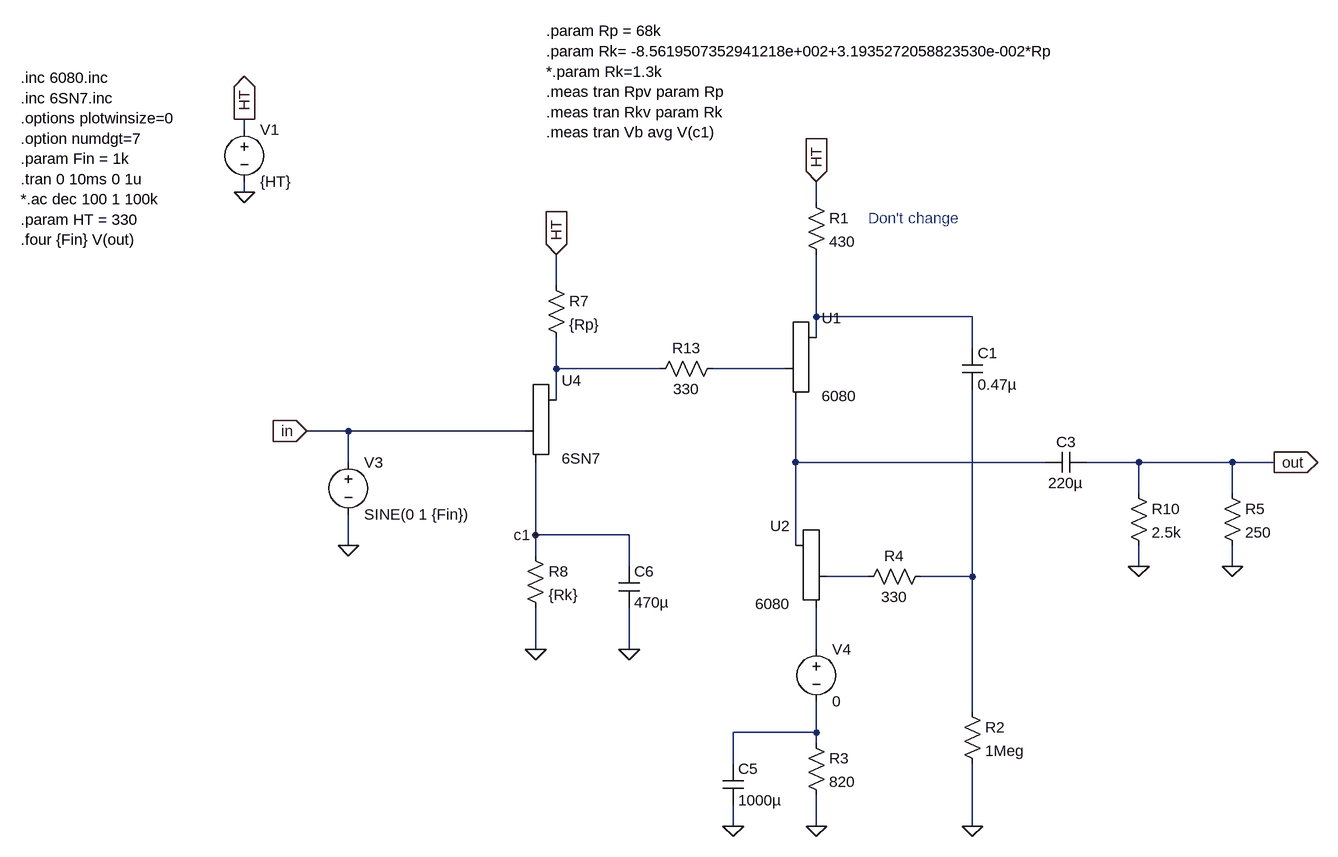
[diagram p0: schematic OTL 6SN7.asc]
OTL 6SN7.asc, the LTspice schematic file:
Version 4
SHEET 1 4876 1028
WIRE -384 -64 -384 -80
WIRE -384 32 -384 16
WIRE 496 48 496 16
WIRE 96 176 96 128
WIRE 496 224 496 128
WIRE 736 224 496 224
WIRE 496 256 496 224
WIRE 736 272 736 224
WIRE 96 304 96 256
WIRE 256 304 96 304
WIRE 448 304 336 304
WIRE 96 352 96 304
WIRE -224 400 -288 400
WIRE 48 400 -224 400
WIRE -224 448 -224 400
WIRE 464 448 464 352
WIRE 848 448 464 448
WIRE 992 448 912 448
WIRE 1136 448 992 448
WIRE 1200 448 1136 448
WIRE 992 496 992 448
WIRE 1136 496 1136 448
WIRE 64 560 64 448
WIRE 208 560 64 560
WIRE -224 576 -224 528
WIRE 464 576 464 448
WIRE 64 592 64 560
WIRE 208 608 208 560
WIRE 992 608 992 576
WIRE 1136 608 1136 576
WIRE 576 624 512 624
WIRE 736 624 736 336
WIRE 736 624 656 624
WIRE 64 736 64 672
WIRE 208 736 208 672
WIRE 496 736 496 672
WIRE 736 832 736 624
WIRE 496 864 496 816
WIRE 496 864 368 864
WIRE 496 880 496 864
WIRE 368 912 368 864
WIRE 368 1008 368 976
WIRE 496 1008 496 960
WIRE 736 1008 736 912
FLAG -384 32 0
FLAG 736 1008 0
FLAG 496 1008 0
FLAG -224 576 0
FLAG 1200 448 out
IOPIN 1200 448 Out
FLAG 1136 608 0
FLAG 368 1008 0
FLAG 496 16 HT
IOPIN 496 16 In
FLAG -384 -80 HT
IOPIN -384 -80 Out
FLAG 64 736 0
FLAG 96 128 HT
IOPIN 96 128 In
FLAG -288 400 in
IOPIN -288 400 In
FLAG 208 736 0
FLAG 992 608 0
FLAG 64 560 c1
SYMBOL Misc/triode 496 304 R0
SYMATTR InstName U1
SYMATTR Value 6080
SYMBOL voltage -384 -80 R0
SYMATTR InstName V1
SYMATTR Value {HT}
SYMBOL res 480 32 R0
SYMATTR InstName R1
SYMATTR Value 430
SYMBOL Misc/triode 464 624 M0
SYMATTR InstName U2
SYMATTR Value 6080
SYMBOL res 720 816 R0
SYMATTR InstName R2
SYMATTR Value 1Meg
SYMBOL cap 720 272 R0
SYMATTR InstName C1
SYMATTR Value 0.47µ
SYMBOL res 480 864 R0
SYMATTR InstName R3
SYMATTR Value 820
SYMBOL voltage -224 432 R0
SYMATTR InstName V3
SYMATTR Value SINE(0 1 {Fin})
SYMATTR Value2 AC 1
SYMBOL cap 912 432 R90
WINDOW 0 0 32 VBottom 2
WINDOW 3 32 32 VTop 2
SYMATTR InstName C3
SYMATTR Value 220µ
SYMBOL res 1120 480 R0
SYMATTR InstName R5
SYMATTR Value 250
SYMBOL cap 352 912 R0
SYMATTR InstName C5
SYMATTR Value 1000µ
SYMBOL voltage 496 720 R0
SYMATTR InstName V4
SYMATTR Value 0
SYMBOL Misc/triode 96 400 R0
SYMATTR InstName U4
SYMATTR Value 6SN7
SYMBOL res 80 160 R0
SYMATTR InstName R7
SYMATTR Value {Rp}
SYMBOL res 48 576 R0
SYMATTR InstName R8
SYMATTR Value {Rk}
SYMBOL cap 192 608 R0
SYMATTR InstName C6
SYMATTR Value 470µ
SYMBOL res 672 608 R90
WINDOW 0 0 56 VBottom 2
WINDOW 3 32 56 VTop 2
SYMATTR InstName R4
SYMATTR Value 330
SYMBOL res 976 480 R0
SYMATTR InstName R10
SYMATTR Value 2.5k
SYMBOL res 352 288 R90
WINDOW 0 0 56 VBottom 2
WINDOW 3 32 56 VTop 2
SYMATTR InstName R13
SYMATTR Value 330
TEXT -728 -144 Left 2 !.inc 6080.inc\n.inc 6SN7.inc\n.options plotwinsize=0\n.option numdgt=7\n.param Fin = 1k\n.tran 0 10ms 0 1u\n*.ac dec 100 1 100k\n.param HT = 330\n.four {Fin} V(out)
TEXT 576 72 Left 2 ;Don't change
TEXT 80 -216 Left 2 !.param Rp = 68k\n.param Rk= -8.5619507352941218e+002+3.1935272058823530e-002*Rp\n*.param Rk=1.3k\n.meas tran Rpv param Rp\n.meas tran Rkv param Rk\n.meas tran Vb avg V(c1)

The netlist it stands for:
* OTL 6SN7.asc
XU1 N001 N003 N004 6080
V1 HT 0 {HT}
R1 HT N001 430
XU2 N004 N005 N007 6080
R2 N006 0 1Meg
C1 N001 N006 0.47µ
R3 N008 0 820
V3 in 0 SINE(0 1 {Fin}) AC 1
C3 out N004 220µ
R5 out 0 250
C5 N008 0 1000µ
V4 N007 N008 0
XU4 N002 in c1 6SN7
R7 HT N002 {Rp}
R8 c1 0 {Rk}
C6 c1 0 470µ
R4 N006 N005 330
R10 out 0 2.5k
R13 N003 N002 330
.inc 6080.inc
.inc 6SN7.inc
.options plotwinsize=0
.option numdgt=7
.param Fin = 1k
.tran 0 10ms 0 1u
*.ac dec 100 1 100k
.param HT = 330
.four {Fin} V(out)
* Don't change
.param Rp = 68k
.param Rk= -8.5619507352941218e+002+3.1935272058823530e-002*Rp
*.param Rk=1.3k
.meas tran Rpv param Rp
.meas tran Rkv param Rk
.meas tran Vb avg V(c1)
.backanno
.end